# EAGLE design WireBender Remix (EAGLE 9.4.2)
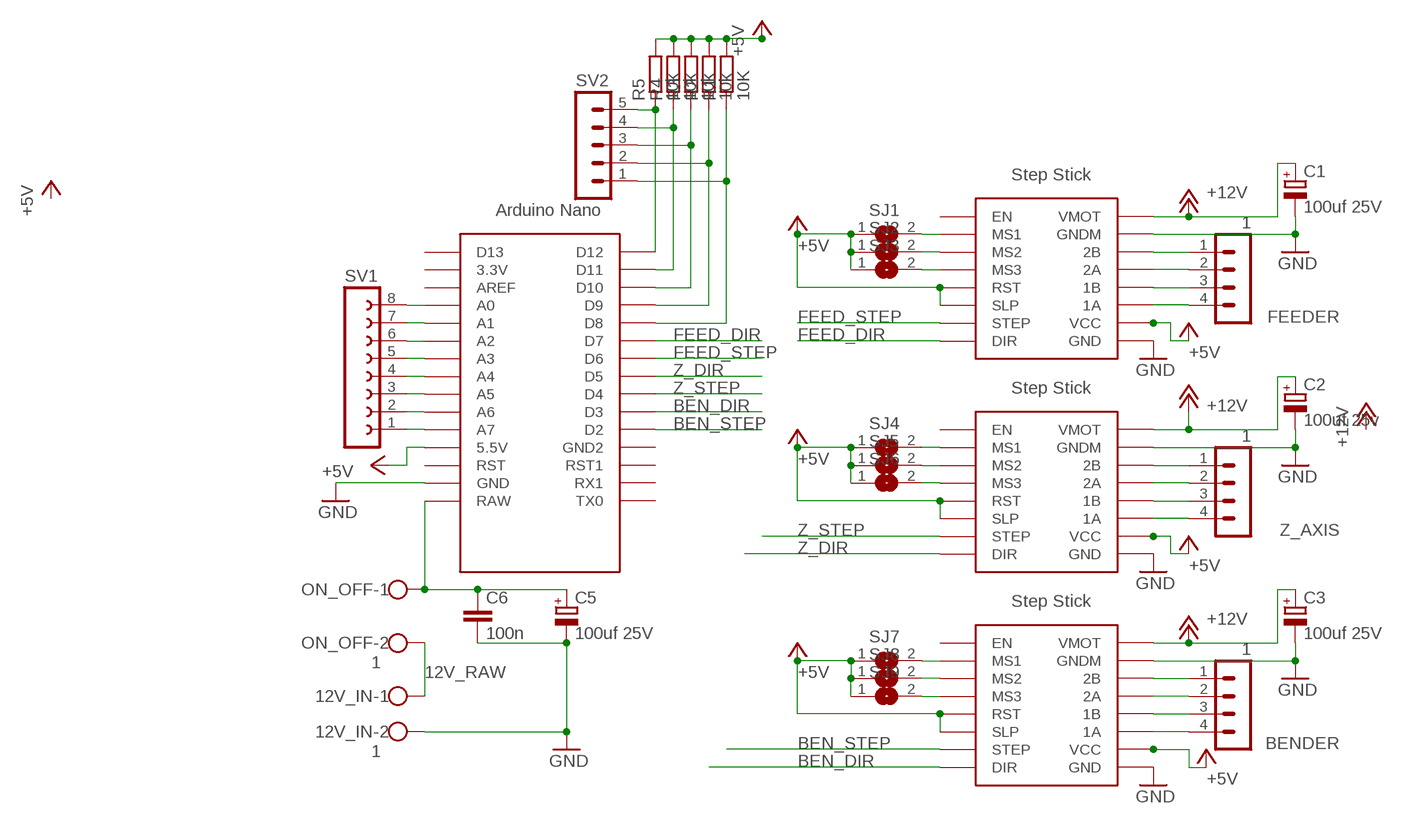
[diagram p0: schematic, sheet 1]

## Parts
12V_IN  1  W237-102  [W237-102]
BENDER  1  MA04-1  [MA04-1]
C1  100uf 25V  CPOL-EUE3.5-8  [E3,5-8]
C2  100uf 25v  CPOL-EUE3.5-8  [E3,5-8]
C3  100uf 25V  CPOL-EUE3.5-8  [E3,5-8]
C5  100uf 25V  CPOL-EUE3.5-8  [E3,5-8]
C6  100n  C-EU025-030X050  [C025-030X050]
FEED_DRV  STEP-STICK  [STEP-STICK]
FEEDER  1  MA04-1  [MA04-1]
ON_OFF  1  W237-102  [W237-102]
R1  10K  R-EU_0207/7  [0207/7]
R2  10k  R-EU_0207/7  [0207/7]
R3  10k  R-EU_0207/7  [0207/7]
R4  10k  R-EU_0207/7  [0207/7]
R5  10k  R-EU_0207/7  [0207/7]
SJ1  SJW  [SJW]
SJ2  SJW  [SJW]
SJ3  SJW  [SJW]
SJ4  SJW  [SJW]
SJ5  SJW  [SJW]
SJ6  SJW  [SJW]
SJ7  SJW  [SJW]
SJ8  SJW  [SJW]
SJ9  SJW  [SJW]
SV1  FE08-1  [FE08]
SV2  MA05-1  [MA05-1]
U$1  NANO  [NANO]
U$3  STEP-STICK  [STEP-STICK]
U$4  STEP-STICK  [STEP-STICK]
Z_AXIS  1  MA04-1  [MA04-1]

## Nets
12V_RAW: 12V_IN.1 ON_OFF.2
+5V: FEED_DRV.RST FEED_DRV.SLP FEED_DRV.VCC R1.2 R2.2 R3.2 R4.2 R5.2 SJ1.1 SJ2.1 SJ3.1 SJ4.1 SJ5.1 SJ6.1 SJ7.1 SJ8.1 SJ9.1 U$1.5V(5.5V) U$3.RST U$3.SLP U$3.VCC U$4.RST U$4.SLP U$4.VCC
+12V: C1.+ C2.+ C3.+ FEED_DRV.VMOT U$3.VMOT U$4.VMOT
BEN_DIR: U$1.D3 U$4.DIR
BEN_STEP: U$1.D2 U$4.SPT(STEP)
FEED_DIR: FEED_DRV.DIR U$1.D7
FEED_STEP: FEED_DRV.SPT(STEP) U$1.D6
GND: 12V_IN.2 C1.- C2.- C3.- C5.- C6.2 FEED_DRV.GND FEED_DRV.GNDM U$1.GND U$3.GND U$3.GNDM U$4.GND U$4.GNDM
N$1: BENDER.4 U$4.1A
N$3: BENDER.3 U$4.1B
N$4: C5.+ C6.1 ON_OFF.1 U$1.RAW
N$5: BENDER.2 U$4.2A
N$6: BENDER.1 U$4.2B
N$7: U$3.1A Z_AXIS.4
N$8: U$3.1B Z_AXIS.3
N$9: U$3.2A Z_AXIS.2
N$10: U$3.2B Z_AXIS.1
N$11: FEED_DRV.1A FEEDER.4
N$12: FEED_DRV.1B FEEDER.3
N$13: FEED_DRV.2A FEEDER.2
N$14: FEED_DRV.2B FEEDER.1
N$15: FEED_DRV.MS1 SJ1.2
N$16: FEED_DRV.MS2 SJ2.2
N$17: FEED_DRV.MS3 SJ3.2
N$18: SJ4.2 U$3.MS1
N$19: SJ5.2 U$3.MS2
N$20: SJ6.2 U$3.MS3
N$21: SJ7.2 U$4.MS1
N$22: SJ8.2 U$4.MS2
N$23: SJ9.2 U$4.MS3
N$24: SV1.1 U$1.A7
N$25: SV1.7 U$1.A1
N$26: SV1.6 U$1.A2
N$27: SV1.5 U$1.A3
N$28: SV1.4 U$1.A4
N$29: SV1.3 U$1.A5
N$30: SV1.2 U$1.A6
N$31: R5.1 SV2.5 U$1.D12
N$32: SV1.8 U$1.A0
N$33: R4.1 SV2.4 U$1.D11
N$34: R3.1 SV2.3 U$1.D10
N$35: R2.1 SV2.2 U$1.D9
N$36: R1.1 SV2.1 U$1.D8
Z_DIR: U$1.D5 U$3.DIR
Z_STEP: U$1.D4 U$3.SPT(STEP)
Unconnected: FEED_DRV.EN U$1.3.3V U$1.AREF U$1.D13 U$1.GND1(GND2) U$1.RST U$1.RST1 U$1.RX1 U$1.TX0 U$3.EN U$4.EN

## Library data of the parts
12V_IN ON_OFF = con-wago-500:W237-102: WAGO SCREW CLAMP; MPN: 237-102; OC_FARNELL: unknown; OC_NEWARK: 70K9898
BENDER FEEDER Z_AXIS = con-lstb:MA04-1: PIN HEADER; OC_FARNELL: unknown; OC_NEWARK: unknown
C1-C3 C5 = rcl:CPOL-EU: POLARIZED CAPACITOR, European symbol; SPICEPREFIX: C
C6 = rcl:C-EU: CAPACITOR, European symbol; SPICEPREFIX: C
FEED_DRV U$3 U$4 = Arduino-clone:STEP-STICK
R1-R5 = rcl:R-EU_: RESISTOR, European symbol; SPICEPREFIX: R
SJ1-SJ9 = jumper:SJ: SMD solder JUMPER
SV1 = con-lsta:FE08-1: FEMALE HEADER; OC_FARNELL: unknown; OC_NEWARK: unknown
SV2 = con-lstb:MA05-1: PIN HEADER; OC_FARNELL: unknown; OC_NEWARK: unknown
U$1 = Arduino-clone:NANO: Arduino Nano

## Board
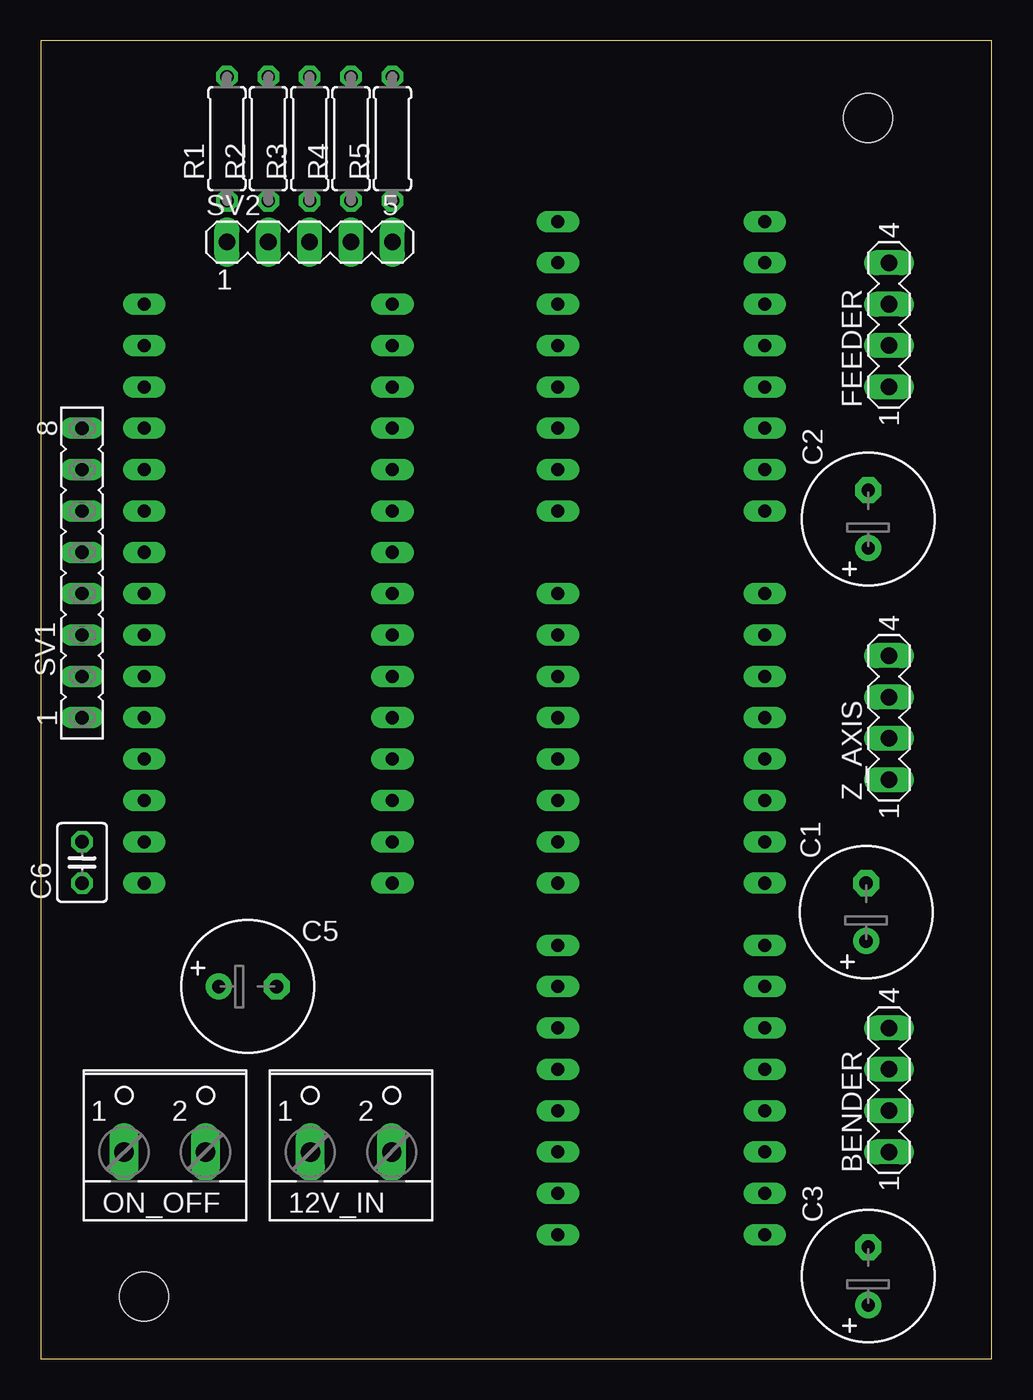
[diagram p1: board, top side]
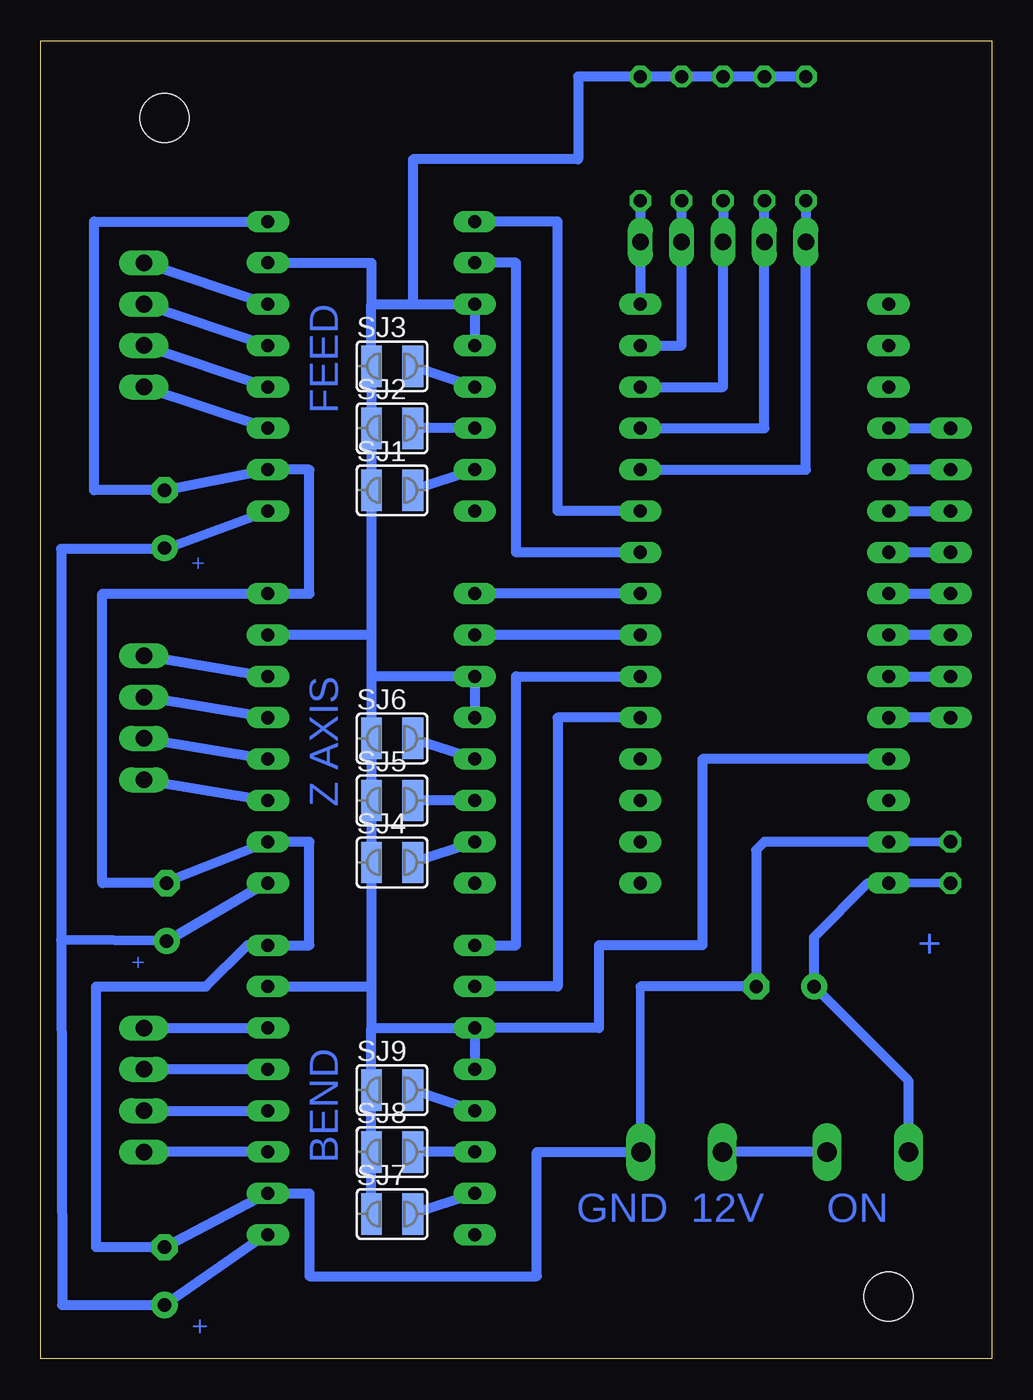
[diagram p2: board, bottom side, seen from below]

Size 58.4 x 80.95 mm. Coordinates in mm from the lower left corner, seen from the top.
Outline: 0,0 58.4,0 58.4,80.95 0,80.95 0,0
Copper layers (1*16): Top 0.035mm / dielectric 1.5mm / Bottom 0.035mm
Design rules "default": minimum track width 6mil, minimum drill 0.35mm, track to track 6mil, track to pad 6mil, pad to pad 6mil, via to via 6mil, smd to smd 6mil, copper to edge 40mil, drill to drill 6mil, minimum pad ring 10mil, minimum via ring 8mil, stop-mask expansion 4mil, vias tented up to drill 0mil, thermal gap 10mil
Holes 3 mm at 6.35,3.81 50.8,76.2

### Footprints (pad centres in the part's own frame; a part is rotated, then mirrored left to right if it is on the bottom)
W237-102 = drill 1.194 long: 1 -2.5,-1.27; 2 2.5,-1.27
MA04-1 = drill 1.016 long: 1 -3.81,0; 2 -1.27,0; 3 1.27,0; 4 3.81,0
E3,5-8 = drill 0.813 pad 1.6: + -1.778,0 | drill 0.813 pad 1.6 octagon: - 1.778,0
C025-030X050 = drill 0.813 octagon: 1 -1.27,0; 2 1.27,0
STEP-STICK = drill 0.8 long: 1A -8.89,-7.62; 1B -8.89,-5.08; 2A -8.89,-2.54; 2B -8.89,0; DIR 3.81,-12.7; EN 3.81,5.08; GND -8.89,-12.7; GNDM -8.89,2.54; MS1 3.81,2.54; MS2 3.81,0; MS3 3.81,-2.54; RST 3.81,-5.08; SLP 3.81,-7.62; SPT 3.81,-10.16; VCC -8.89,-10.16; VMOT -8.89,5.08
0207/7 = drill 0.813 octagon: 1 -3.81,0; 2 3.81,0
SJW = smd 1.27 x 2.54: 1 -1.27,0; 2 1.27,0
FE08 = drill 0.813 long: 1 -8.89,0; 2 -6.35,0; 3 -3.81,0; 4 -1.27,0; 5 1.27,0; 6 3.81,0; 7 6.35,0; 8 8.89,0
MA05-1 = drill 1.016 long: 1 -5.08,0; 2 -2.54,0; 3 0,0; 4 2.54,0; 5 5.08,0
NANO = drill 0.8 long: 3.3V -10.16,24.13; 5V -10.16,-1.27; A0 -10.16,19.05; A1 -10.16,16.51; A2 -10.16,13.97; A3 -10.16,11.43; A4 -10.16,8.89; A5 -10.16,6.35; A6 -10.16,3.81; A7 -10.16,1.27; AREF -10.16,21.59; D2 5.08,1.27; D3 5.08,3.81; D4 5.08,6.35; D5 5.08,8.89; D6 5.08,11.43; D7 5.08,13.97; D8 5.08,16.51; D9 5.08,19.05; D10 5.08,21.59; D11 5.08,24.13; D12 5.08,26.67; D13 -10.16,26.67; GND -10.16,-6.35; GND1 5.08,-1.27; RAW -10.16,-8.89; RST -10.16,-3.81; RST1 5.08,-3.81; RX1 5.08,-6.35; TX0 5.08,-8.89

### Placement (x,y rotation side)
12V_IN  19.05,13.97 0 top
BENDER  52.07,16.51 90 top
C1  50.67,27.43 90 top
C2  50.8,51.56 90 top
C3  50.8,5.08 90 top
C5  12.7,22.86 0 top
C6  2.54,30.48 90 top
FEED_DRV  35.56,57.15 180 top
FEEDER  52.07,63.5 90 top
ON_OFF  7.62,13.97 0 top
R1  11.43,74.93 90 top
R2  13.97,74.93 90 top
R3  16.51,74.93 90 top
R4  19.05,74.93 90 top
R5  21.59,74.93 90 top
SJ1  36.83,53.34 0 bottom
SJ2  36.83,57.15 0 bottom
SJ3  36.83,60.96 0 bottom
SJ4  36.83,30.48 0 bottom
SJ5  36.83,34.29 0 bottom
SJ6  36.83,38.1 0 bottom
SJ7  36.83,8.89 0 bottom
SJ8  36.83,12.7 0 bottom
SJ9  36.83,16.51 0 bottom
SV1  2.54,48.26 90 top
SV2  16.51,68.58 0 top
U$1  16.51,38.1 0 top
U$3  35.56,34.29 180 top
U$4  35.56,12.7 180 top
Z_AXIS  52.07,39.37 90 top

### Tracks (layer width: path | path; a pad name or v marks a point on that pad's centre or on a via)
12V_RAW
  Bottom 0.61: ON_OFF.2 12V_IN.1
+5V
  Bottom 0.61: R1.2 R2.2 R3.2 R4.2 R5.2 25.4,78.74 25.4,73.66 35.56,73.66 35.56,64.77 | U$3.RST U$3.SLP 38.1,41.91 | SJ7.1 SJ8.1 SJ9.1 38.1,20.32 | 38.1,20.32 U$4.SLP | U$4.SLP U$4.RST | 38.1,64.77 SJ3.1 SJ2.1 SJ1.1 38.1,44.45 | 38.1,64.77 35.56,64.77 | 35.56,64.77 FEED_DRV.SLP FEED_DRV.RST | FEED_DRV.VCC 38.1,67.31 38.1,64.77 | 38.1,44.45 U$3.VCC | 38.1,44.45 38.1,41.91 | 38.1,41.91 SJ6.1 SJ5.1 SJ4.1 38.1,22.86 | 38.1,22.86 38.1,20.32 | U$4.VCC 38.1,22.86 | U$1.5V 17.78,36.83 17.78,25.4 24.13,25.4 24.13,20.32 U$4.SLP
+12V
  Bottom 0.61: C2.+ 50.73,49.75 | 50.73,49.75 FEED_DRV.VMOT | U$3.VMOT 44.58,29.21 C1.+ 57.15,25.74 | U$4.VMOT 44.62,7.62 C3.+ 57.09,3.3 57.15,25.74 | 57.15,25.74 57.15,49.75 50.73,49.75
BEN_DIR
  Bottom 0.61: U$4.DIR 29.21,25.4 29.21,41.91 U$1.D3
BEN_STEP
  Bottom 0.61: U$1.D2 26.67,39.37 26.67,22.86 U$4.SPT
FEED_DIR
  Bottom 0.61: U$1.D7 26.67,52.07 26.67,69.85 FEED_DRV.DIR
FEED_STEP
  Bottom 0.61: U$1.D6 29.21,49.53 29.21,67.31 FEED_DRV.SPT
GND
  Bottom 0.508: 21.59,22.86 21.59,12.7 | U$1.GND C6.2
  Bottom 0.61: FEED_DRV.GND 55.12,69.85 55.12,53.34 C2.- FEED_DRV.GNDM 41.91,54.61 41.91,46.99 U$3.GND 54.61,46.99 54.61,29.21 C1.- 50.72,29.29 U$3.GNDM 41.91,31.75 41.91,25.4 U$4.GND 45.72,25.4 48.26,22.86 54.99,22.86 54.99,6.86 C3.- U$4.GNDM 41.91,10.16 41.91,5.08 27.94,5.08 27.94,12.7 21.59,12.7 12V_IN.2 | 21.59,22.86 C5.- 14.48,31.24 13.97,31.75 U$1.GND
N$1
  Bottom 0.61: BENDER.4 U$4.1A
N$3
  Bottom 0.61: U$4.1B BENDER.3
N$4
  Bottom 0.508: C6.1 U$1.RAW
  Bottom 0.61: U$1.RAW 7.62,29.21 10.92,25.91 C5.+ 5.12,17.06 ON_OFF.1
N$5
  Bottom 0.61: BENDER.2 U$4.2A
N$6
  Bottom 0.61: U$4.2B BENDER.1
N$7
  Bottom 0.61: Z_AXIS.4 U$3.1A
N$8
  Bottom 0.61: U$3.1B Z_AXIS.3
N$9
  Bottom 0.61: Z_AXIS.2 U$3.2A
N$10
  Bottom 0.61: Z_AXIS.1 U$3.2B
N$11
  Bottom 0.61: FEEDER.4 FEED_DRV.1A
N$12
  Bottom 0.61: FEED_DRV.1B FEEDER.3
N$13
  Bottom 0.61: FEED_DRV.2A FEEDER.2
N$14
  Bottom 0.61: FEED_DRV.2B FEEDER.1
N$15
  Bottom 0.61: FEED_DRV.MS1 SJ1.2
N$16
  Bottom 0.61: FEED_DRV.MS2 SJ2.2
N$17
  Bottom 0.61: FEED_DRV.MS3 SJ3.2
N$18
  Bottom 0.61: U$3.MS1 SJ4.2
N$19
  Bottom 0.61: U$3.MS2 SJ5.2
N$20
  Bottom 0.61: SJ6.2 U$3.MS3
N$21
  Bottom 0.61: U$4.MS1 SJ7.2
N$22
  Bottom 0.61: U$4.MS2 SJ8.2
N$23
  Bottom 0.61: U$4.MS3 SJ9.2
N$24
  Bottom 0.61: SV1.1 U$1.A7
N$25
  Bottom 0.61: SV1.7 U$1.A1
N$26
  Bottom 0.61: U$1.A2 SV1.6
N$27
  Bottom 0.61: SV1.5 U$1.A3
N$28
  Bottom 0.61: U$1.A4 SV1.4
N$29
  Bottom 0.61: SV1.3 U$1.A5
N$30
  Bottom 0.61: U$1.A6 SV1.2
N$31
  Bottom 0.61: R5.1 SV2.5 U$1.D12
N$32
  Bottom 0.61: U$1.A0 SV1.8
N$33
  Bottom 0.61: R4.1 SV2.4 19.05,62.23 U$1.D11
N$34
  Bottom 0.61: R3.1 SV2.3 16.51,59.69 U$1.D10
N$35
  Bottom 0.61: R2.1 SV2.2 13.97,57.15 U$1.D9
N$36
  Bottom 0.61: R1.1 SV2.1 11.43,54.61 U$1.D8
Z_DIR
  Bottom 0.61: U$1.D5 U$3.DIR
Z_STEP
  Bottom 0.61: U$1.D4 U$3.SPT

### Text on the board
Bottom: FEED | + | Z AXIS | + | + | BEND | ON | GND 12V | +